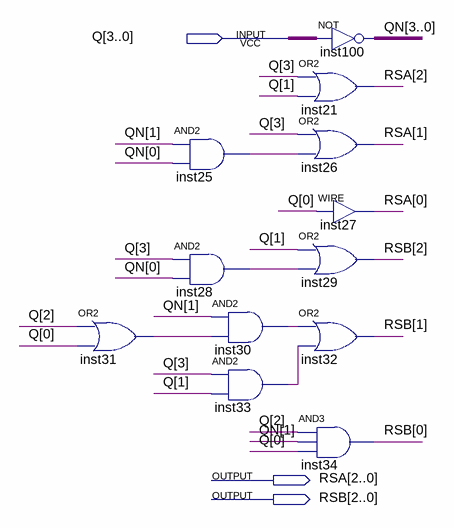
[diagram p0: schematic sheet]
// Quartus schematic RS.bdf as structural Verilog: 12 symbols, 3 pins
module RS (
  input  [3:0] Q,
  output [2:0] RSA,
  output [2:0] RSB
);

  wire inst25_out, inst28_out, inst30_out, inst31_out, inst33_out;
  wire [3:0] QN;

  or inst31 (inst31_out, Q[2], Q[0]);
  and inst25 (inst25_out, QN[1], QN[0]);
  and inst28 (inst28_out, Q[3], QN[0]);
  and inst30 (inst30_out, QN[1], inst31_out);
  and inst33 (inst33_out, Q[3], Q[1]);
  or inst21 (RSA[2], Q[3], Q[1]);
  or inst26 (RSA[1], Q[3], inst25_out);
  or inst29 (RSB[2], Q[1], inst28_out);
  or inst32 (RSB[1], inst30_out, inst33_out);
  and inst34 (RSB[0], Q[2], QN[1], Q[0]);
  assign QN = ~Q;  // NOT inst100, 4 bits wide
  assign RSA[0] = Q[0];  // WIRE inst27
endmodule
